# EAGLE design decoder (EAGLE 8.2.2)
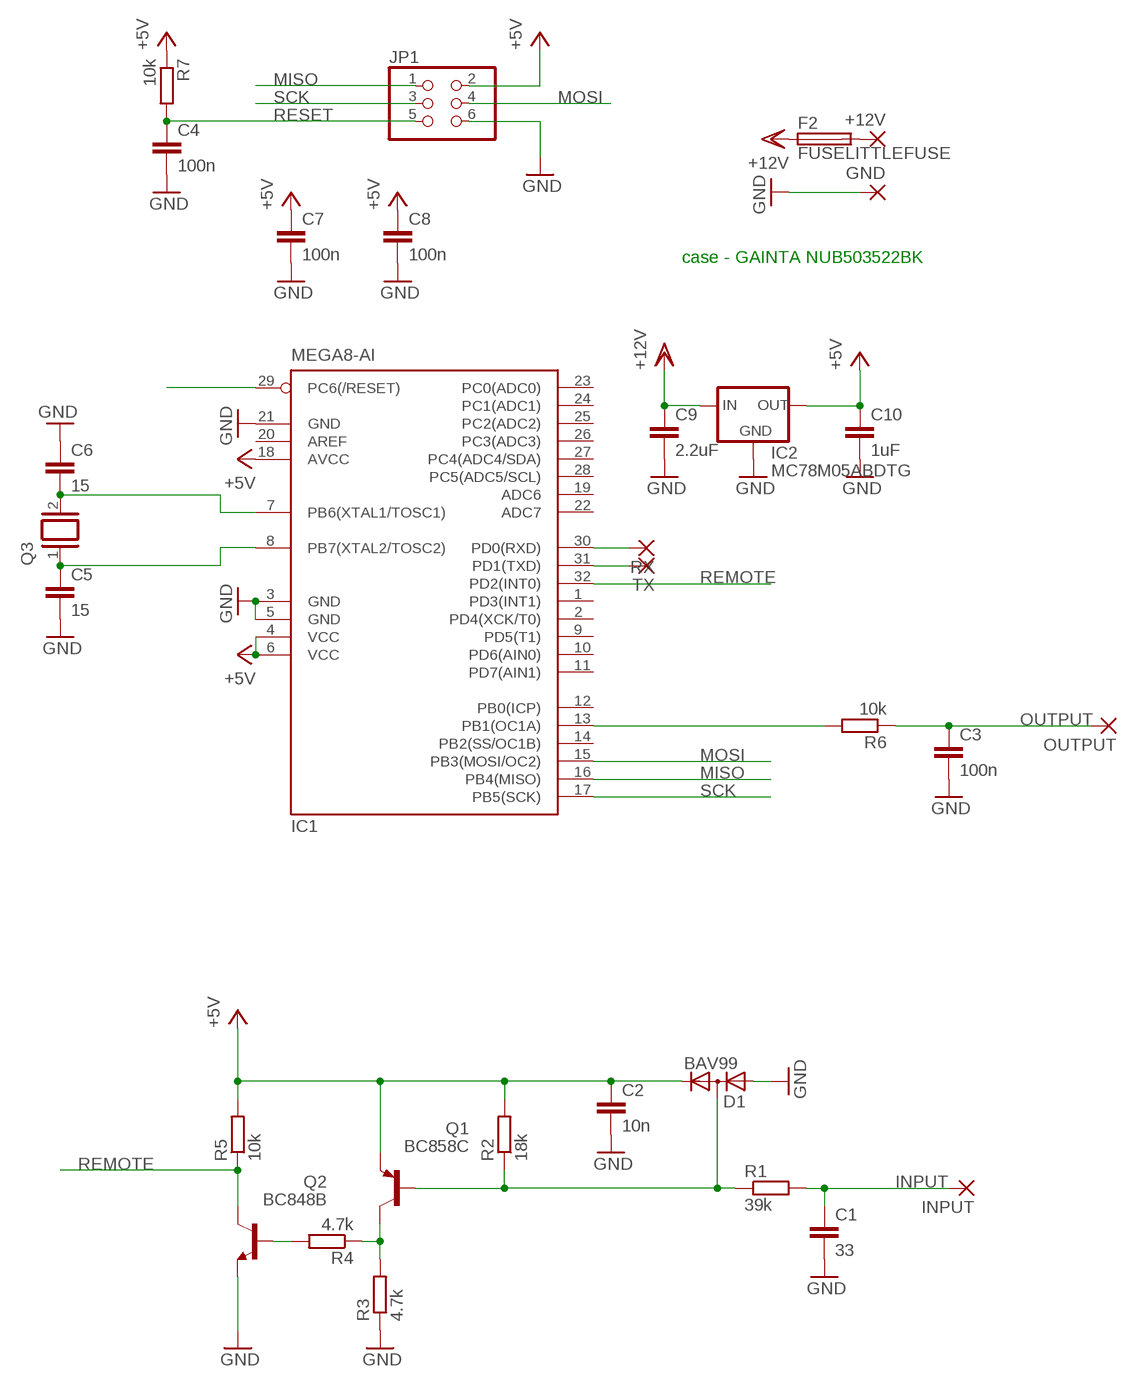
[diagram p0: schematic, sheet 1]

## Parts
+12V  3,81/1,4  [3,81/1,4]
C1  33  C-EUC0603  [C0603]
C2  10n  C-EUC0603  [C0603]
C3  100n  C-EUC0603  [C0603]
C4  100n  C-EUC0603  [C0603]
C5  15  C-EUC0603  [C0603]
C6  15  C-EUC0603  [C0603]
C7  100n  C-EUC0603  [C0603]
C8  100n  C-EUC0603  [C0603]
C9  2.2uF  C-EUC3225  [C3225]
C10  1uF  C-EUC1206  [C1206]
D1  BAV99  BAV199  [SOT23]
F2  FUSELITTLEFUSE  [LITTLEFUSE]
GND  3,81/1,4  [3,81/1,4]
IC1  MEGA8-AI  [TQFP32-08]
IC2  MC78M05ABDTG  LP2950CDT-5.0  [DPACK]
INPUT  2,54/1,1  [2,54/1,1]
JP1  PINHD-2X3  [2X03]
OUTPUT  2,54/1,1  [2,54/1,1]
Q1  BC858C  BC858CLT1SMD  [SOT23-BEC]
Q2  BC848B  BC848BSMD  [SOT23]
Q3  XTAL/S  [QS]
R1  39k  R-EU_R0603  [R0603]
R2  18k  R-EU_R0603  [R0603]
R3  4.7k  R-EU_R0603  [R0603]
R4  4.7k  R-EU_R0603  [R0603]
R5  10k  R-EU_R0603  [R0603]
R6  10k  R-EU_R0603  [R0603]
R7  10k  R-EU_R0603  [R0603]
RX  1,6/0,8  [1,6/0,8]
TX  1,6/0,8  [1,6/0,8]

## Nets
GND [PWR]: C1.2 C2.2 C3.2 C4.2 C5.2 C6.1 C7.2 C8.2 C9.2 C10.2 D1.1(A) GND.1(P) IC1.3(GND) IC1.5(GND) IC1.21(GND) IC2.4(GND) JP1.6 Q2.2(E) R3.1
INPUT: C1.1 INPUT.1(P) R1.2
MISO: IC1.16(PB4(MISO)) JP1.1
MOSI: IC1.15(PB3(MOSI/OC2)) JP1.4
N$1: D1.3(AC) Q1.B R1.1 R2.1
N$2: +12V.1(P) F2.2
N$3: Q1.C R3.2 R4.1
N$4: Q2.1(B) R4.2
N$7: IC1.30(PD0(RXD)) RX.1(P)
N$8: IC1.31(PD1(TXD)) TX.1(P)
N$10: IC1.13(PB1(OC1A)) R6.2
N$11: C6.2 IC1.7(PB6(XTAL1/TOSC1)) Q3.2
N$12: C5.1 IC1.8(PB7(XTAL2/TOSC2)) Q3.1
OUTPUT [PWR]: C3.1 OUTPUT.1(P) R6.1
REMOTE [PWR]: IC1.32(PD2(INT0)) Q2.3(C) R5.1
RESET: C4.1 IC1.29(PC6(/RESET)) JP1.5 R7.2
SCK: IC1.17(PB5(SCK)) JP1.3
VCC: C2.1 C7.1 C8.1 C10.1 D1.2(C) IC1.4(VCC) IC1.6(VCC) IC1.18(AVCC) IC2.3(OUT) JP1.2 Q1.E R2.2 R5.2 R7.1 ; supply symbol labelled +5V
VDD [PWR]: C9.1 F2.1 IC2.1(IN) ; supply symbol labelled +12V
Unconnected: IC1.1(PD3(INT1)) IC1.2(PD4(XCK/T0)) IC1.9(PD5(T1)) IC1.10(PD6(AIN0)) IC1.11(PD7(AIN1)) IC1.12(PB0(ICP)) IC1.14(PB2(SS/OC1B)) IC1.19(ADC6) IC1.20(AREF) IC1.22(ADC7) IC1.23(PC0(ADC0)) IC1.24(PC1(ADC1)) IC1.25(PC2(ADC2)) IC1.26(PC3(ADC3)) IC1.27(PC4(ADC4/SDA)) IC1.28(PC5(ADC5/SCL))

## Notes on the sheet
- case - GAINTA NUB503522BK

## Library data of the parts
+12V GND = wirepad:3,81/1,4: THROUGH-HOLE PAD
C1-C10 = resistor:C-EU: CAPACITOR, European symbol
D1 = diode:BAV199: DIODE low-leakage double diode
F2 = fuse:FUSE: Fuse; OC_FARNELL: unknown; OC_NEWARK: unknown
IC1 = atmel:MEGA8: MICROCONTROLLER 8 Kbytes FLASH, 1 kbytes SRAM, 512 bytes EEPROM, USART, 6-channel 10 bit ADC, 2-channel 8 bit ADC Pin compatible with Atmega48, ATMega88, ATMega168 Source: avr.lbr; MPN: ATMEGA8-16AU; OC_FARNELL: 9171371; OC_NEWARK: 73M8863
IC2 = v-reg:LP2950?*: Source: http://cache.national.com/ds/LP/LP2950.pdf
INPUT OUTPUT = wirepad:2,54/1,1: THROUGH-HOLE PAD
JP1 = pinhead:PINHD-2X3: PIN HEADER
Q1 = transistor-pnp:BC858*: PNP Transistror
Q2 = transistor-npn:BC848*: NPN Transistor
Q3 = special:XTAL/S: CRYSTAL
R1-R7 = resistor:R-EU_: RESISTOR, European symbol
RX TX = wirepad:1,6/0,8: THROUGH-HOLE PAD

## Net classes
0 default: width 0.4 mm
1 PWR: width 0.5 mm

## Board
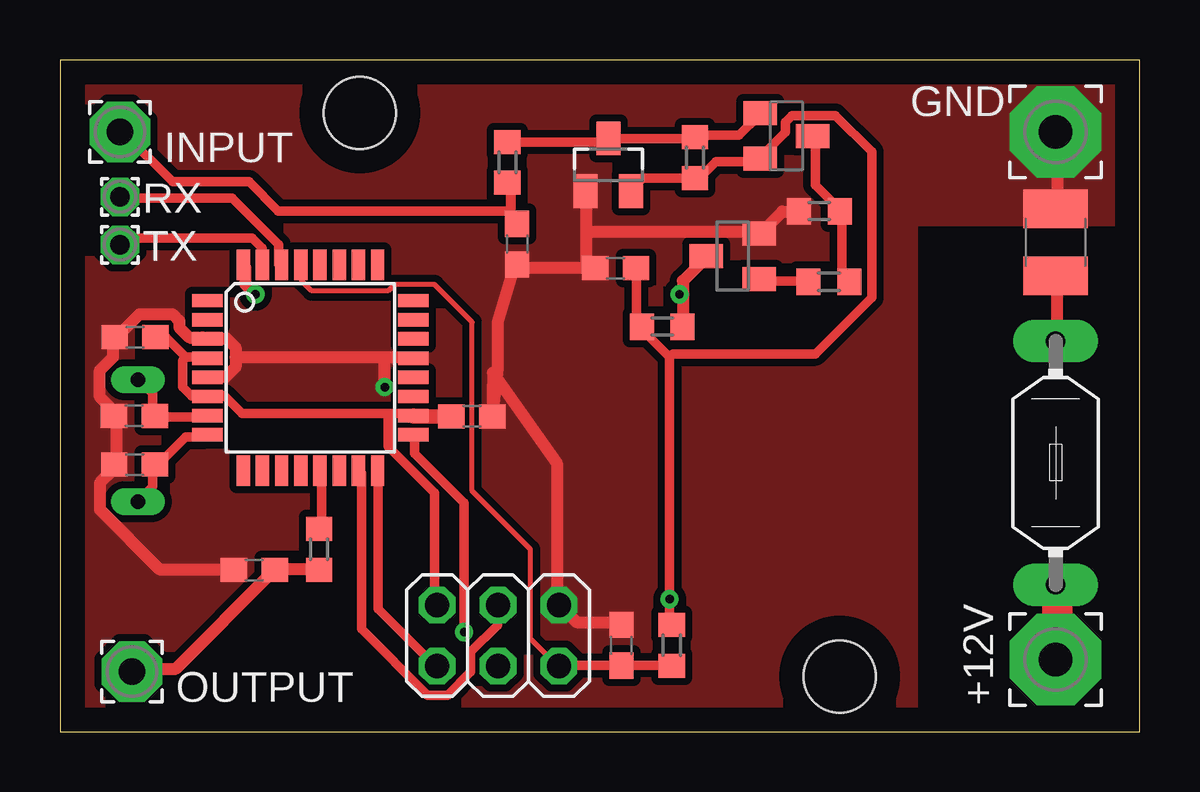
[diagram p1: board, top side]
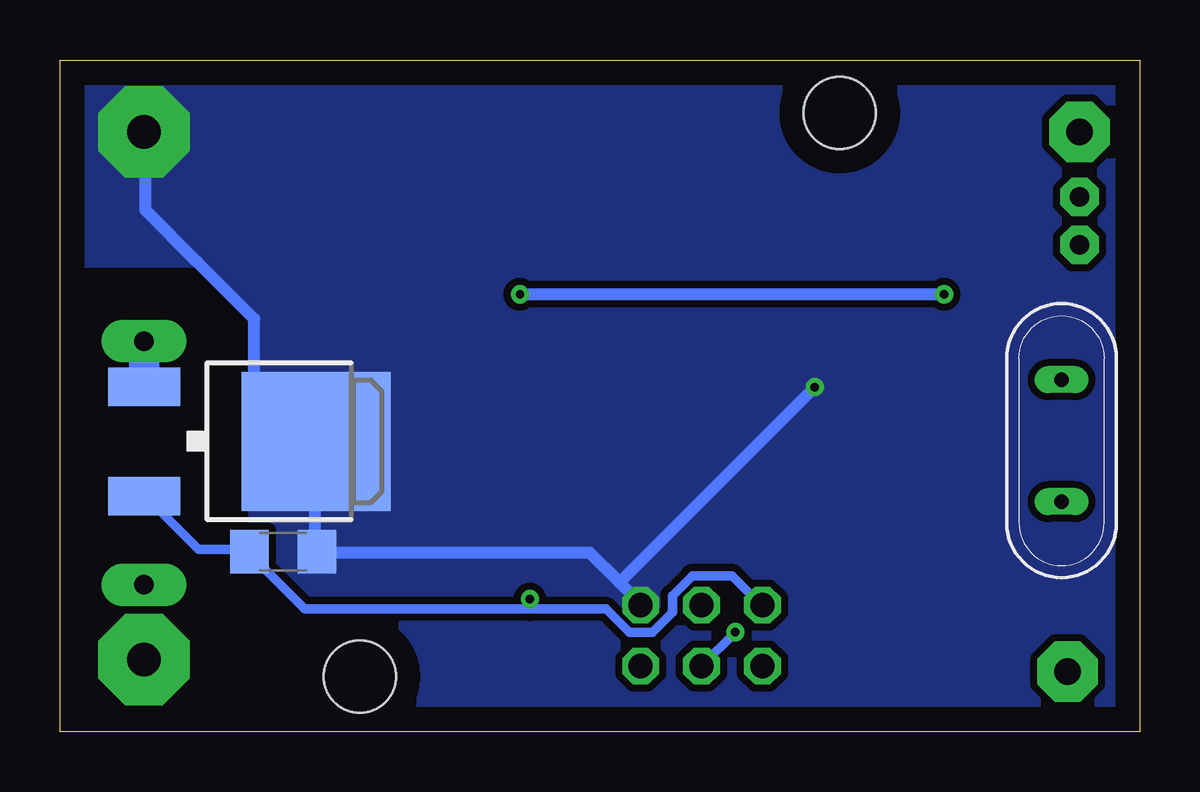
[diagram p2: board, bottom side, seen from below]

Size 45 x 28 mm. Coordinates in mm from the lower left corner, seen from the top.
Outline: 0,0 45,0 45,28 0,28 0,0
Copper layers (1*16): Top 0.035mm / dielectric 1.5mm / Bottom 0.035mm
Design rules "default": minimum track width 6mil, minimum drill 0.35mm, track to track 6mil, track to pad 6mil, pad to pad 6mil, via to via 6mil, smd to smd 6mil, copper to edge 40mil, drill to drill 6mil, minimum pad ring 10mil, minimum via ring 8mil, stop-mask expansion 4mil, vias tented up to drill 0mil, thermal gap 10mil
Holes 3 mm at 32.5,2.3 12.5,25.8

### Footprints (pad centres in the part's own frame; a part is rotated, then mirrored left to right if it is on the bottom)
3,81/1,4 = drill 1.397 pad 3.81 octagon: 1 0,0
C0603 = smd 1.1 x 1: 1 -0.85,0; 2 0.85,0
C3225 = smd 1.6 x 2.7: 1 -1.4,0; 2 1.4,0
C1206 = smd 1.6 x 1.8: 1 -1.4,0; 2 1.4,0
SOT23 = smd 1 x 1.4: 1 -0.95,-1.1; 2 0.95,-1.1; 3 0,1.1
LITTLEFUSE = drill 0.813 pad 1.778 long: 1 -5.08,0; 2 5.08,0
TQFP32-08 = smd 1.27 x 0.559: 1 -4.293,2.8; 2 -4.293,2; 3 -4.293,1.2; 4 -4.293,0.4; 5 -4.293,-0.4; 6 -4.293,-1.2; 7 -4.293,-2; 8 -4.293,-2.8; 17 4.293,-2.8; 18 4.293,-2; 19 4.293,-1.2; 20 4.293,-0.4; 21 4.293,0.4; 22 4.293,1.2; 23 4.293,2; 24 4.293,2.8 | smd 0.559 x 1.27: 9 -2.8,-4.293; 10 -2,-4.293; 11 -1.2,-4.293; 12 -0.4,-4.293; 13 0.4,-4.293; 14 1.2,-4.293; 15 2,-4.293; 16 2.8,-4.293; 25 2.8,4.293; 26 2,4.293; 27 1.2,4.293; 28 0.4,4.293; 29 -0.4,4.293; 30 -1.2,4.293; 31 -2,4.293; 32 -2.8,4.293
DPACK = smd 1.6 x 3: 1 -2.28,-4.8; 3 2.28,-4.8 | smd 5.8 x 6.2: 4 0,2.38
2,54/1,1 = drill 1.118 pad 2.54 octagon: 1 0,0
2X03 = drill 1.016 octagon: 1 -2.54,-1.27; 2 -2.54,1.27; 3 0,-1.27; 4 0,1.27; 5 2.54,-1.27; 6 2.54,1.27
SOT23-BEC = smd 1 x 1.4: B -0.95,-1.1; C 0,1.1; E 0.95,-1.1
QS = drill 0.61 long: 1 -2.54,0; 2 2.54,0
R0603 = smd 1 x 1.1: 1 -0.85,0; 2 0.85,0
1,6/0,8 = drill 0.813 pad 1.6 octagon: 1 0,0

### Placement (x,y rotation side)
+12V  41.5,3 0 top
C1  19.05,20.32 270 top
C2  23.16,19.32 180 top
C3  8.1,6.73 180 top
C4  23.4,3.6 90 top
C5  3.11,11.14 180 top
C6  3.1,13.16 0 top
C7  17.17,13.14 0 top
C8  3.13,16.44 180 top
C9  41.5,20.4 90 top
C10  35.7,7.5 0 bottom
D1  22.86,23.63 0 top
F2  41.5,11.2 270 top
GND  41.5,25 0 top
IC1  10.44,15.17 0 top
IC2  36.7,12.1 270 bottom
INPUT  2.5,25 0 top
JP1  18.26,4 0 top
OUTPUT  3,2.5 0 top
Q1  30.28,24.83 270 top
Q2  28.04,19.82 90 top
Q3  3.25,12.13 90 bottom
R1  18.65,23.73 270 top
R2  26.47,23.93 270 top
R3  31.65,21.69 0 top
R4  32.05,18.75 180 top
R5  25.1,16.88 180 top
R6  10.8,7.6 90 top
R7  25.5,3.6 270 top
RX  2.5,22.3 0 top
TX  2.5,20.3 0 top

### Tracks (layer width: path | path; a pad name or v marks a point on that pad's centre or on a via)
GND  (via drill 0.35)
  Top 0.5: 7.32,15.61 7.32,16.02 6.94,16.4 6.11,16.4 IC1.3 5.94,16.43 5.39,16.43 4.97,16.85 4.97,17.12 4.7,17.4 3.31,17.4 2.49,16.57 C8.2 2.21,16.43 2.21,15.61 1.66,15.05 1.66,13.95 2.21,13.4 C6.1 2.35,13.12 2.35,11.19 C5.2 2.21,10.91 1.66,10.36 1.66,9.25 4.14,6.77 7.18,6.77 C3.2 | 7.32,15.61 7.32,15.19 6.91,14.78 6.21,14.78 IC1.5 | 7.32,15.61 13.53,15.61 | 13.53,15.61 14.64,15.61 IC1.21 | C9.2 41.57,21.82 41.57,25.41 GND.1 | C4.2 23.34,4.56 21.54,4.56 20.85,5.25 JP1.6 20.71,5.39 20.71,11.19 18.05,14.95 C7.2 18.25,15.13 18.25,17.06 18.92,19.33 C1.2 19.2,19.33 22.23,19.33 C2.2 21.96,19.47 21.96,20.85 | R3.1 30.11,21.68 29.28,20.85 Q2.2 29,20.85 21.96,20.85 | 21.96,20.85 21.96,22.51 D1.1 | v13.53,14.36 13.53,15.61
  Bottom 0.5: 21.68,6.21 20.85,5.39 JP1.6 | 21.68,6.21 22.93,7.46 34.11,7.46 C10.2 34.39,7.6 34.39,12.02 IC2.4 34.39,12.29 36.9,12.29 36.9,17.2 39.3,19.6 41.43,21.73 41.43,25.41 GND.1 | 21.68,6.21 v13.53,14.36
  pour Top (isolate 0.3, no thermals): 1.3,26.9 44.2,26.9 44.2,21.3 35.5,21.3 35.5,0.9 1.3,0.9
  pour Bottom (isolate 0.3, no thermals): 0.9,27.1 44,27.1 44,19.6 39.3,19.6 36.9,17.2 36.9,0.9 0.9,0.9
INPUT
  Top 0.4: C1.1 18.92,21.27 18.78,21.41 18.78,22.79 R1.2 18.8,22.52 18.8,21.8 18.7,21.7 9.1,21.7 7.88,22.93 4.7,22.93 2.62,25 INPUT.1
MISO
  Top 0.4: IC1.16 13.26,10.77 13.26,5.11 15.61,2.76 JP1.1
MOSI
  Top 0.4: IC1.15 12.57,10.77 12.57,4.28 15.33,1.52 16.16,1.52 17.12,2.49 17.12,3.31 18.23,4.42 18.23,5.25 JP1.4
N$1
  Top 0.4: Q1.B 29.14,25.69 28.31,24.86 26.52,24.86 R2.1 26.38,24.72 23.06,24.72 D1.3 22.79,24.72 22.65,24.58 18.78,24.58 R1.1
N$2
  Top 0.4: 41.57,6.08 F2.2 | 41.57,2.62 +12V.1
  Top 1.27: 41.57,2.62 41.57,6.08
N$3
  Top 0.4: R4.1 32.87,18.78 32.59,19.06 32.59,21.68 R3.2 32.45,21.82 31.49,22.79 31.49,24.72 Q1.C
N$4
  Top 0.4: R4.2 31.07,18.78 29.28,18.78 Q2.1
N$7
  Top 0.4: IC1.30 9.12,19.47 9.12,20.3 7.18,22.23 2.62,22.23 RX.1
N$8
  Top 0.4: IC1.31 8.42,19.47 8.42,20.16 8.01,20.58 2.9,20.58 2.62,20.3 TX.1
N$10
  Top 0.4: R6.2 10.91,8.56 10.91,10.77 IC1.13
N$11
  Top 0.4: Q3.2 3.31,14.64 3.87,14.09 3.87,13.26 C6.2 4.14,13.12 6.08,13.12 IC1.7
N$12
  Top 0.4: Q3.1 3.31,9.67 3.87,10.22 3.87,11.05 C5.1 4.14,11.19 5.25,12.29 6.08,12.29 IC1.8
OUTPUT
  Top 0.5: R6.1 10.77,6.77 8.98,6.77 C3.1 8.84,6.63 4.83,2.62 3.04,2.62 OUTPUT.1
REMOTE  (via drill 0.35)
  Top 0.5: 25.96,18.23 25.96,18.78 26.93,19.75 Q2.3 | 25.96,18.23 25.96,16.99 R5.1 | v8.15,18.23 7.73,18.64 7.73,19.33 IC1.32 | v25.82,18.23 25.96,18.23
  Bottom 0.5: v25.82,18.23 v8.15,18.23
RESET
  Top 0.203: 10.08,19.33 10.08,18.78 10.5,18.37 13.67,18.37 13.95,18.64 15.61,18.64 17.18,17.07 17.18,10.02 19.61,7.6 19.61,3.87 20.71,2.76
  Top 0.4: R7.2 25.41,2.76 23.48,2.76 C4.1 23.2,2.76 20.99,2.76 JP1.5 20.71,2.76 | 10.08,19.33 IC1.29
SCK  (via drill 0.35)
  Top 0.4: v16.85,4.14 16.85,9.53 14.78,11.6 14.78,12.29 IC1.17
  Bottom 0.4: v16.85,4.14 18.23,2.76 JP1.3
VCC  (via drill 0.35)
  Top 0.4: D1.2 23.89,22.65 24.31,23.06 26.38,23.06 R2.2 26.65,23.06 27.34,23.75 29.14,23.75 Q1.E 29.28,24.03 30.24,25 30.24,25.41 30.52,25.69 32.31,25.69 33.83,24.17 33.83,18.09 31.49,15.74 25.55,15.74 25.41,15.61 | C2.1 24.03,19.2 24.03,17.12 24.17,16.99 R5.2 24.31,16.71 25.41,15.61 | 25.41,15.61 v25.41,5.52 25.41,4.56 R7.1 | 5.25,15.61 4.42,16.43 4,16.43 C8.1 | 5.25,15.61 6.08,15.61 IC1.4 | 5.25,15.61 5.11,15.47 5.11,14.36 5.49,13.99 6.18,13.99 IC1.6 6.01,14.01 6.84,14.01 7.6,13.26 13.67,13.26 | 13.67,13.26 14.64,13.26 IC1.18 | 13.67,13.26 13.67,11.88 15.61,9.94 15.61,5.39 JP1.2
  Top 0.61: C7.1 14.73,13.14 IC1.18
  Bottom 0.4: IC2.3 41.43,9.8 39.22,7.6 37.15,7.6 C10.1 37.01,7.46 37.06,7.36 34.81,5.11 25.41,5.11 | 25.41,5.11 22.23,5.11 21.27,4.14 20.3,4.14 19.47,4.97 19.47,5.66 18.64,6.49 16.99,6.49 15.88,5.39 JP1.2 | 25.41,5.11 v25.41,5.52
VDD
  Top 0.5: C9.1 41.57,18.92 41.57,16.3 F2.1
  Bottom 1.27: F2.1 IC2.1